# Altium schematic sheet MainSchematic.SchDoc: Power Switching TO220
size A4; Date: 15/04/2020; Author: A.STARK; CompanyName: Personnel dev; DocumentNumber: 1; Revision: v1.0; SheetNumber: 1; SheetTotal: 1; Address: BOUXWILLER, France; BoardName: Power Switching; Vout: Vout 5V; Vin: Vin 6V to 30V
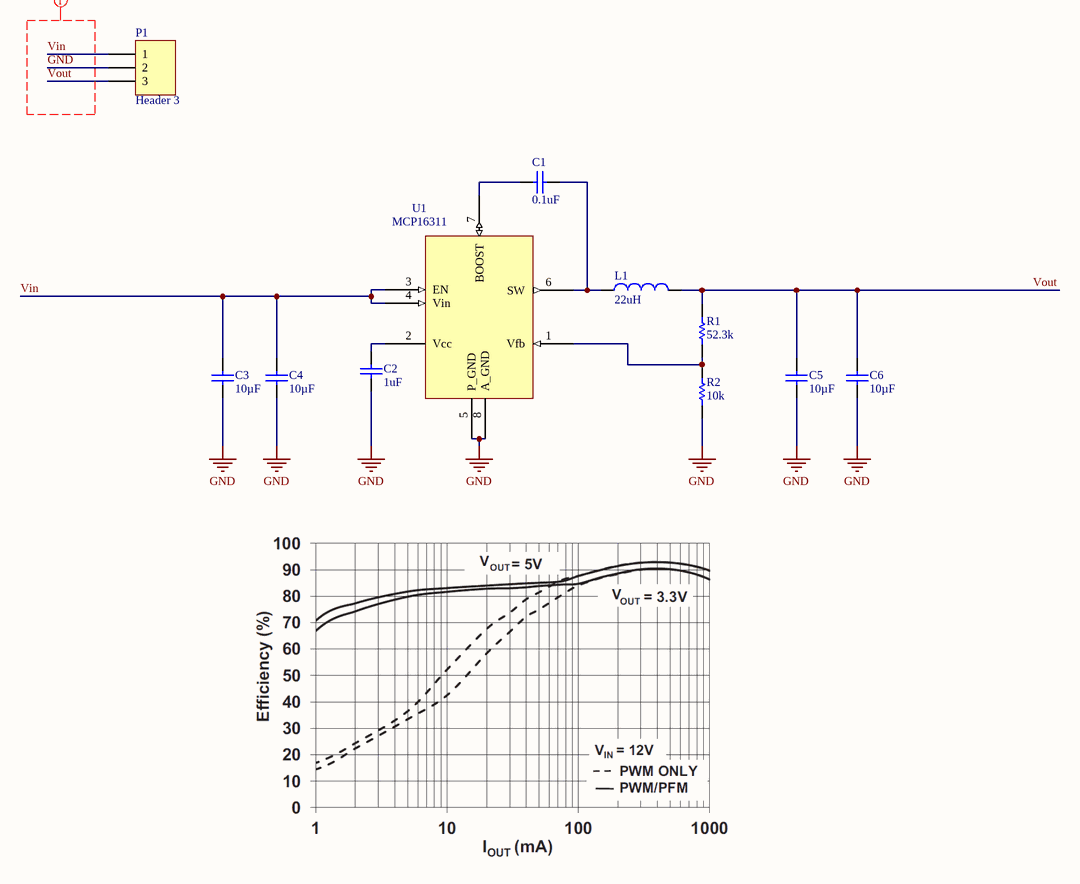
[diagram p0: MainSchematic.SchDoc]

## Parts
C1  0.1uF  [CAPC1005X55X30NL05T10]
C2  1uF  [CAPC1608X90X35LL15T15]
C3  10µF  [CAPC1608X90X35NL10T15]
C4  10µF  [CAPC1608X90X35NL10T15]
C5  10µF  [CAPC1005X70X10NL05]
C6  10µF  [CAPC1005X70X10NL05]
L1  22uH  [Coil CMS TDK VLCF]
P1  Header 3  [HDR1X3]
R1  52.3k  [RESC0402(1005)_N]
R2  10k  [RESC0402(1005)_N]
U1  MCP16311  [TDFN-MN8]

## Nets
GND: C2.1 C3.2 C4.2 C5.1 C6.1 P1.2 R2.1 U1.5(P_GND) U1.8(A_GND)
Vin: C3.1 C4.1 P1.1 U1.3(EN) U1.4(Vin)
Vout: C5.2 C6.2 L1.2 P1.3 R1.2
NetC1_1: C1.1 U1.7(BOOST)
NetC1_2: C1.2 L1.1 U1.6(SW)
NetC2_2: C2.2 U1.2(Vcc)
NetR1_1: R1.1 R2.2 U1.1(Vfb)

## Layout directives
net class Power: GND, Vin, Vout

## Notes on the sheet
- Sheet
- Assembly
- Board
- Rev.
- /
- Author
- Printed

## Library data of the parts
C1 = CMP-2008-03087-1: Mfg: Kemet; MfgPn: C0402C104K9RACTU; Value: 0.1uF
C2 = CMP-2006-02241-1: MfgPn: C0603C105K9PACTU; Mfg: Kemet; Value: 1uF
C3 C4 = CMP-2006-02792-1: MfgPn: GRM188R6YA106MA73D; Mfg: Murata; Value: 10µF
C5 C6 = CMP-2000-05993-1: Chip Capacitor, 10 uF, +/- 20%, -55 to 85 degC, 0402 (1005 Metric), RoHS, Tape and Reel; Manufacturer: TDK; Voltage - Rated: 10V; Product Training Modules: CSeriesGeneralApplicationsSEAT,CCV,andTVCLDesignToolsGuidetoReplacinganElectrolyticCapacitorwithanMLCC; Online Catalog: CSeries,GeneralPurpose; Temperature Coefficient: X5R; MfgPn: CL05A106MP8NUB8; Mfg: Samsung; Standard Package: 1; Datasheet URL: https://media.digikey.com/pdf/Data%20Sheets/Samsung%20PDFs/CL05A106MP8NUB8_Spec.pdf; Package Description: 2-Pin Surface Mount Device, Body 1.00 x 0.50 mm; Lead Style: -; Capacitance: 10µF; RoHS Information: RoHSCertificate-MLCC; Mounting Technology: SurfaceMount; Manufacturer URL: http://www.tdk.com/; Packaging: CutTape(CT); Series: C; Category: Capacitors; Operating Temperature: -55°C~85°C; Ratings: -; Applications: GeneralPurpose; Lead Spacing: -; Family: CeramicCapacitors; Mounting Type: SurfaceMount,MLCC; Package / Case: 0402(1005Metric); Features: -; Thickness (Max): 0.020"(0.50mm); Size / Dimension: 0.039"Lx0.020"W(1.00mmx0.50mm); Datasheet Version: 03/2015; Package Reference: 0402; Tolerance: ±20%; Height - Seated (Max): -; Value: 10µF
L1 = Ind 22uH 1.1A CMS: Inductance bobinée CMS, 22 μH, 1.1A max , dimensions 5.3 x 5 x 2mm, Blindé, série VLCF; Mfg: TDK; MfgPn: VLCF5020T-220MR58; Value: 22uH; ComponentLink1Description: Datasheet; ComponentLink1URL: https://docs.rs-online.com/d546/0900766b814e91e4.pdf; Supplier 3: Farnell; Supplier 4: RSComponents; Supplier 5: RSComponents; Supplier 6: Mouser; Supplier 1: Digi-Key; Supplier 2: Digi-Key; Supplier Part Number 1: 445-3200-1-ND; Supplier Part Number 2: 445-3200-6-ND; Supplier Part Number 3: 1670097; Supplier Part Number 4: 6142841; Supplier Part Number 5: 6142841P; Supplier Part Number 6: 810-VLCF5020T220MR58
P1 = Header 3: Header, 3-Pin; LatestRevisionDate: 17-Jul-2002; LatestRevisionNote: Re-released for DXP Platform.; Publisher: Altium Limited
R1 = CMP-1011-00705-1: 52K3 0.063W 1% 0402 (1005 Metric)  SMD; Case-EIA: 0402; Case-Metric: 1005; Power: 0.063 W; Technology: SMT; Tolerance: 1 %; Value: 52.3k
R2 = CMP-1011-00623-1: 10K 0.063W 1% 0402 (1005 Metric)  SMD; Case-Metric: 1005; Case-EIA: 0402; Value: 10k; Tolerance: 1 %; Technology: SMT; Power: 0.063 W
U1 = MCP16311: 30V Input, 1A Output, High-Efficiency,Integrated Synchronous Switch Step-Down Regulator; Mfg: Microchip; ComponentLink1Description: Datasheet; ComponentLink1URL: http://ww1.microchip.com/downloads/en/DeviceDoc/MCP16311-Family-Data-Sheet-DS20005255C.pdf; Supplier Part Number 1: MCP16311T-E/MNYCT-ND; Supplier Part Number 10: 8243088P; Supplier Part Number 11: 8243088; Supplier Part Number 12: 579-MCP16311-E/MS; Supplier Part Number 13: MCP16311T-E/MSCT-ND; Supplier Part Number 14: MCP16311T-E/MSDKR-ND; Supplier Part Number 15: 2857601; Supplier Part Number 16: 579-MCP16311T-E/MS; Supplier Part Number 2: MCP16311T-E/MNYDKR-ND; Supplier Part Number 3: 8417526; Supplier Part Number 4: 8417526P; Supplier Part Number 5: 2857600; Supplier Part Number 6: 579-MCP16311T-E/MNY; Supplier Part Number 7: MCP16311-E/MS-ND; Supplier Part Number 8: 2414134; Supplier Part Number 9: MCP16311-E/MS; Supplier 9: Avnet; Supplier 8: Farnell; Supplier 7: Digi-Key; Supplier 6: Mouser; Supplier 5: Farnell; Supplier 4: RSComponents; Supplier 3: RSComponents; Supplier 2: Digi-Key; Supplier 15: Farnell; Supplier 16: Mouser; Supplier 14: Digi-Key; Supplier 13: Digi-Key; Supplier 12: Mouser; Supplier 11: RSComponents; Supplier 10: RSComponents; Supplier 1: Digi-Key; MfgPn: MCP16311